# EAGLE design bc29 (EAGLE 7.1.0)
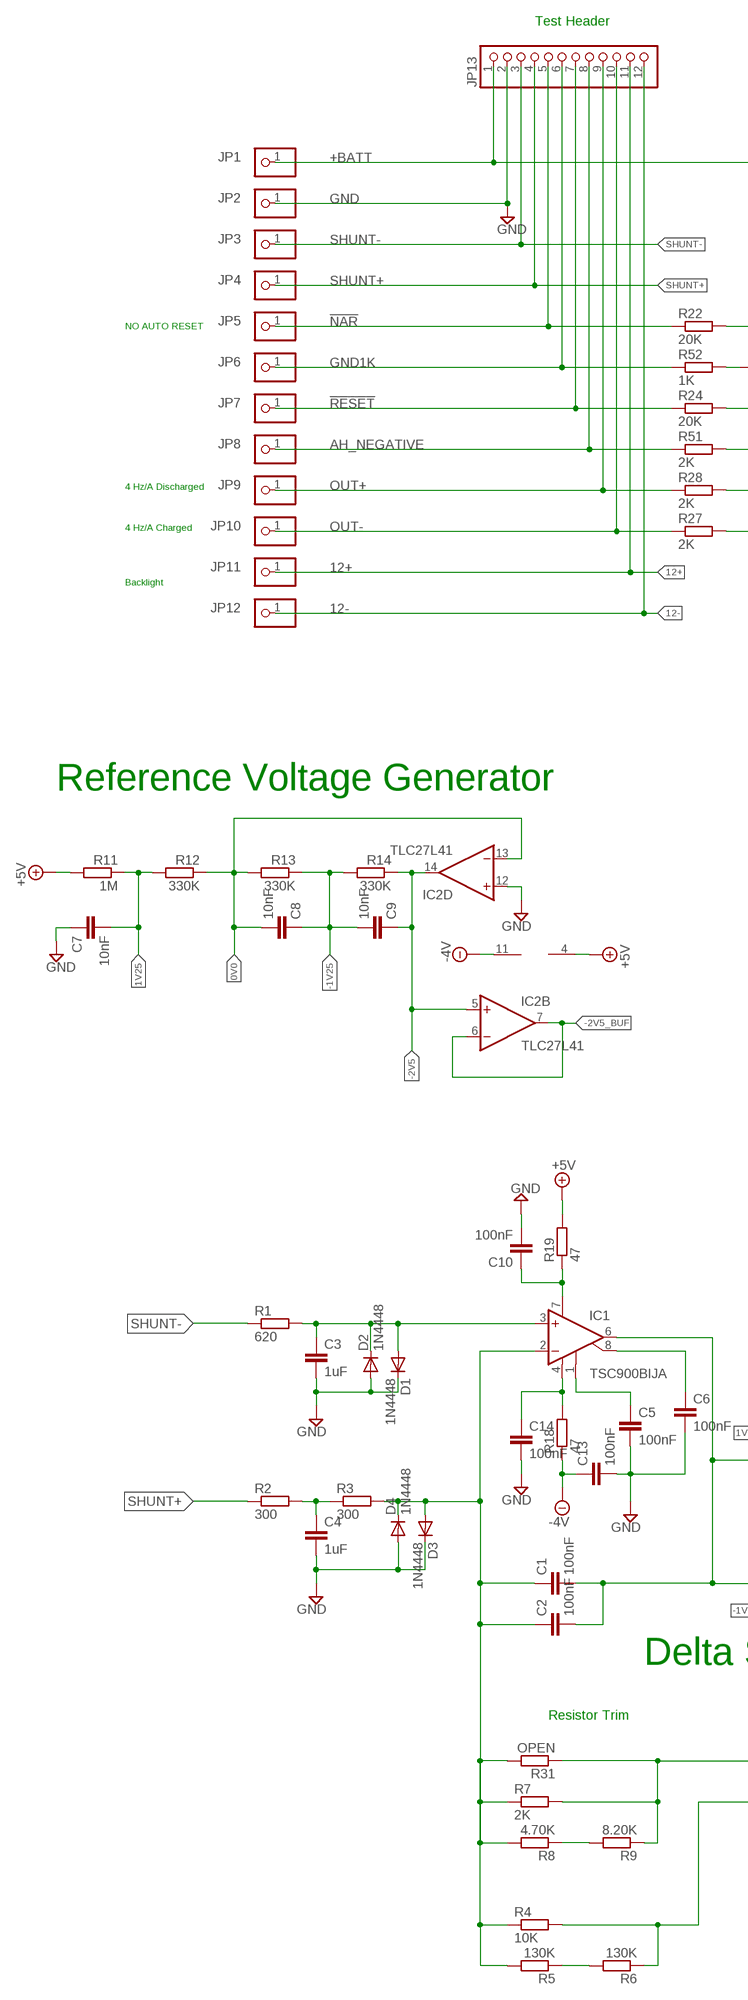
[diagram p0: schematic, sheet 1, part 1 of 2]
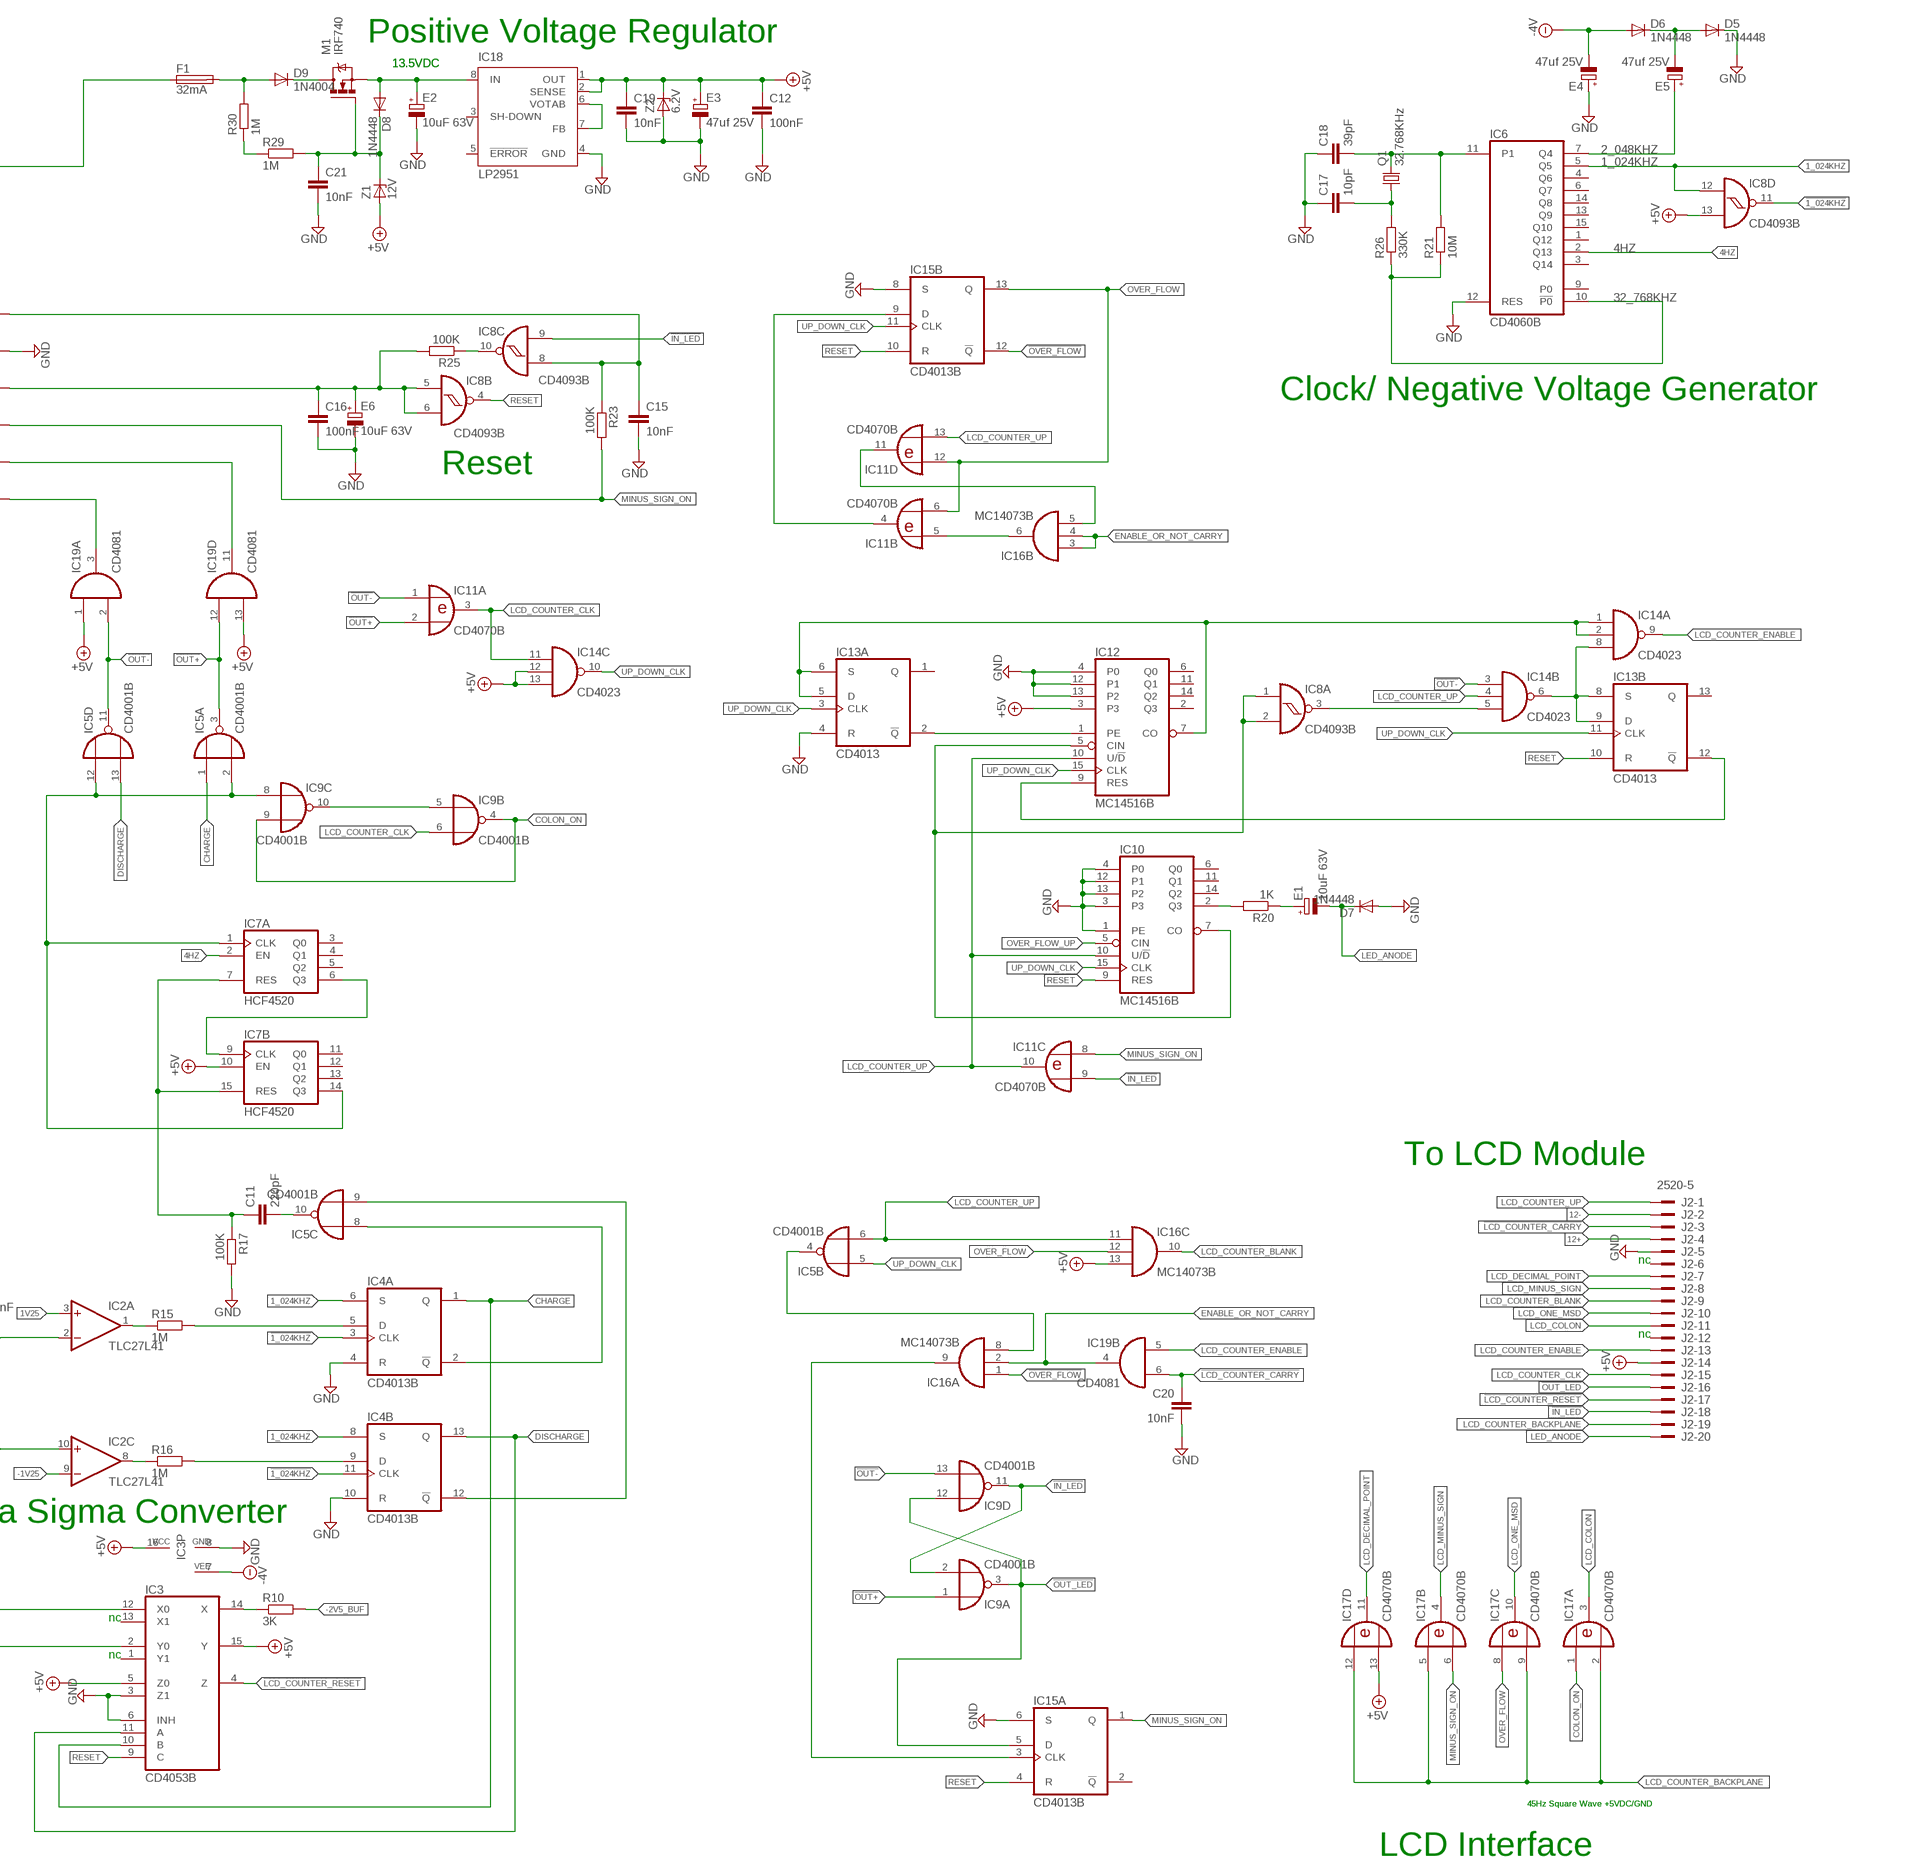
[diagram p1: schematic, sheet 1, part 2 of 2]

## Parts
C1  100nF  C-EUC1206  [C1206]
C2  100nF  C-EUC1206  [C1206]
C3  1uF  C-EU050-045X075  [C050-045X075]
C4  1uF  C-EU050-045X075  [C050-045X075]
C5  100nF  C-EUC1206  [C1206]
C6  100nF  C-EUC1206  [C1206]
C7  10nF  C-EUC0805  [C0805]
C8  10nF  C-EUC0805  [C0805]
C9  10nF  C-EUC0805  [C0805]
C10  100nF  C-EUC1206  [C1206]
C11  220pF  C-EUC0805  [C0805]
C12  100nF  C-EUC1206  [C1206]
C13  100nF  C-EUC1206  [C1206]
C14  100nF  C-EUC1206  [C1206]
C15  10nF  C-EUC0805  [C0805]
C16  100nF  C-EUC1206  [C1206]
C17  10pF  C-EUC0805  [C0805]
C18  39pF  C-EUC0805  [C0805]
C19  10nF  C-EUC0805  [C0805]
C20  10nF  C-EU050-024X044  [C050-024X044]
C21  10nF  C-EUC0805  [C0805]
D1  1N4448  DIODE-MINIMELF  [MINIMELF]
D2  1N4448  DIODE-MINIMELF  [MINIMELF]
D3  1N4448  DIODE-MINIMELF  [MINIMELF]
D4  1N4448  DIODE-MINIMELF  [MINIMELF]
D5  1N4448  DIODE-MINIMELF  [MINIMELF]
D6  1N4448  DIODE-MINIMELF  [MINIMELF]
D7  1N4448  DIODE-MINIMELF  [MINIMELF]
D8  1N4448  DIODE-MINIMELF  [MINIMELF]
D9  1N4004  DIODE-SOD80C  [SOD80C]
E1  10uF 63V  CPOL-EUE2.5-5  [E2,5-5]
E2  10uF 63V  CPOL-EUE2.5-5  [E2,5-5]
E3  47uf 25V  CPOL-EUE2.5-5  [E2,5-5]
E4  47uf 25V  CPOL-EUE2.5-5  [E2,5-5]
E5  47uf 25V  CPOL-EUE2.5-5  [E2,5-5]
E6  10uF 63V  CPOL-EUE2.5-5  [E2,5-5]
F1  32mA  FUSEBLANK_5X20MM  [FUSE_HOLDER_5X20MM]
IC1  TSC900BIJA  2CMPN  [DIL08]
IC2  TLC27L41  TLC274D  [SO14]
IC3  CD4053B  4053D  [SO16]
IC4  CD4013B  4013D  [SO14]
IC5  CD4001B  4001D  [SO14]
IC6  CD4060B  4060D  [SO16]
IC7  HCF4520  4520D  [SO16]
IC8  CD4093B  4093D  [SO14]
IC9  CD4001B  4001D  [SO14]
IC10  MC14516B  4516D  [SO16]
IC11  CD4070B  4070D  [SO14]
IC12  MC14516B  4516D  [SO16]
IC13  CD4013  4013D  [SO14]
IC14  CD4023  4023D  [SO14]
IC15  CD4013B  4013D  [SO14]
IC16  MC14073B  4073D  [SO14]
IC17  CD4070B  4070D  [SO14]
IC18  LP2951  LP2951D  [SO08]
IC19  CD4081  4081D  [SO14]
J2  2520-5  [PAK100/2500-5-20]
JP1  PINHD-1X1  [1X01]
JP2  PINHD-1X1  [1X01]
JP3  PINHD-1X1  [1X01]
JP4  PINHD-1X1  [1X01]
JP5  PINHD-1X1  [1X01]
JP6  PINHD-1X1  [1X01]
JP7  PINHD-1X1  [1X01]
JP8  PINHD-1X1  [1X01]
JP9  PINHD-1X1  [1X01]
JP10  PINHD-1X1  [1X01]
JP11  PINHD-1X1  [1X01]
JP12  PINHD-1X1  [1X01]
JP13  PINHD-1X12  [1X12]
M1  IRF740  [TO220BV]
Q1  32.768KHz  CRYSTALTC26H  [TC26H]
R1  620  R-EU_M0805  [M0805]
R2  300  R-EU_M0805  [M0805]
R3  300  R-EU_M0805  [M0805]
R4  10K  R-EU_M0805  [M0805]
R5  130K  R-EU_0207/10  [0207/10]
R6  130K  R-EU_0207/10  [0207/10]
R7  2K  R-EU_M0805  [M0805]
R8  4.70K  R-EU_0207/10  [0207/10]
R9  8.20K  R-EU_0207/10  [0207/10]
R10  3K  R-EU_M0805  [M0805]
R11  1M  R-EU_M0805  [M0805]
R12  330K  R-EU_M0805  [M0805]
R13  330K  R-EU_M0805  [M0805]
R14  330K  R-EU_M0805  [M0805]
R15  1M  R-EU_M0805  [M0805]
R16  1M  R-EU_M0805  [M0805]
R17  100K  R-EU_M0805  [M0805]
R18  47  R-EU_M0805  [M0805]
R19  47  R-EU_M0805  [M0805]
R20  1K  R-EU_M0805  [M0805]
R21  10M  R-EU_M0805  [M0805]
R22  20K  R-EU_M0805  [M0805]
R23  100K  R-EU_M0805  [M0805]
R24  20K  R-EU_M0805  [M0805]
R25  100K  R-EU_M0805  [M0805]
R26  330K  R-EU_M0805  [M0805]
R27  2K  R-EU_M0805  [M0805]
R28  2K  R-EU_M0805  [M0805]
R29  1M  R-EU_M0805  [M0805]
R30  1M  R-EU_M0805  [M0805]
R31  OPEN  R-EU_0207/10  [0207/10]
R51  2K  R-EU_M0805  [M0805]
R52  1K  R-EU_M0805  [M0805]
Z1  12V  ZENER-DIODESOD80C  [SOD80C]
Z2  6.2V  ZENER-DIODESOD80C  [SOD80C]

## Nets
0V0: C8.2 IC2.13(D:-IN) R12.1 R13.2
1_024KHZ: IC4.6(A:S) IC4.8(B:S) IC6.5(Q5) IC8.12(D:I0)
1V25: C7.2 IC2.3(A:+IN) R11.1 R12.2
2_048KHZ: E5.+ IC6.7(Q4)
4HZ: IC6.2(Q13) IC7.2(A:EN)
12+: J2.4 JP11.1 JP13.11
12-: J2.2 JP12.1 JP13.12
13V5: D8.A E2.+ IC18.8(IN) M1.S
32_768KHZ: IC6.10(!P0) R21.1 R26.1
!1_024KHZ: IC4.3(A:CLK) IC4.11(B:CLK) IC8.11(D:O)
!CHARGE: IC4.2(A:!Q) IC5.8(C:I0)
!DISCHARGE: IC4.12(B:!Q) IC5.9(C:I1)
!IN_LED: IC8.9(C:I1) IC9.2(A:I1) IC9.11(D:O) IC11.9(C:I1) J2.18
!LCD_COUNTER_CARRY: C20.1 IC19.6(B:I1) J2.3
!LCD_COUNTER_RESET: IC3.4(Z) J2.17
!NAR: JP5.1 JP13.5 R22.1
!NAR_R: C15.1 IC8.8(C:I0) R22.2 R23.1
!OUT+: IC5.3(A:O) IC9.1(A:I0) IC11.2(A:I1) IC19.12(D:I0)
!OUT-: IC5.11(D:O) IC9.13(D:I1) IC11.1(A:I0) IC14.3(B:I0) IC19.2(A:I1)
!OUT_LED: IC9.3(A:O) IC9.12(D:I0) IC15.5(A:D) J2.16
!OVER_FLOW: IC15.12(B:!Q) IC16.1(A:I0)
!RESET: JP7.1 JP13.7 R24.1
+5V: C12.1 C19.1 E3.+ IC2.4(P:V+) IC3.5(Z0) IC3.15(Y) IC3.16(VCC) IC7.10(B:EN) IC8.13(D:I1) IC12.3 IC14.12(C:I1) IC14.13(C:I2) IC16.13(C:I2) IC17.13(D:I1) IC18.1(OUT) IC18.2(SENSE) IC19.1(A:I0) IC19.13(D:I1) J2.14 R11.2 R19.2 Z1.A Z2.C
+BATT: F1.1 JP1.1 JP13.1
-1V25: C8.1 C9.2 IC2.9(C:-IN) R13.1 R14.2
-2V5: C9.1 IC2.5(B:+IN) IC2.14(D:OUT) R14.1
-2V5_BUF: IC2.6(B:-IN) IC2.7(B:OUT) R10.2
-2V5_BUF_R: IC3.14(X) R10.1
-4V: D6.A E4.-
-5V: C13.1 IC2.11(P:V-) IC3.7(VEE) R18.1 ; supply symbol labelled -4V
AH_NEGATIVE: JP8.1 JP13.8 R51.1
CHARGE: IC3.10(B) IC4.1(A:Q) IC5.1(A:I0)
COLON_ON: IC9.4(B:O) IC9.9(C:I1) IC17.1(A:I0)
CXA: C5.1 IC1.1(CMP1)
CXB: C6.1 IC1.8(CMP2)
D_CHARGE: IC4.5(A:D) R15.2
D_DISCHARGE: IC4.9(B:D) R16.2
DISCHARGE: IC3.11(A) IC4.13(B:Q) IC5.13(D:I1)
DRAIN: D9.C M1.D
ENABLE_OR_NOT_CARRY: IC16.2(A:I1) IC16.3(B:I0) IC16.4(B:I1) IC19.4(B:O)
FUSED_BATT+: D9.A F1.2 R30.2
GATE: C21.1 D8.C M1.G R29.2 Z1.C
GND: C3.2 C4.2 C5.2 C6.2 C7.1 C10.2 C12.2 C13.2 C14.2 C15.2 C16.2 C17.1 C18.1 C19.2 C20.2 C21.2 D1.C D2.A D3.C D4.A D5.C D7.A E2.- E3.- E4.+ E6.- IC2.12(D:+IN) IC3.3(Z1) IC3.6(INH) IC3.8(GND) IC4.4(A:R) IC4.10(B:R) IC6.12(RES) IC10.1(PE) IC10.3 IC10.4(P0) IC10.12(P1) IC10.13(P2) IC12.4(P0) IC12.12(P1) IC12.13(P2) IC13.4(A:R) IC15.6(A:S) IC15.8(B:S) IC18.4(GND) J2.5 JP2.1 JP13.2 R17.2 R52.2 Z2.A
GND1K: JP6.1 JP13.6 R52.1
IC3-11: IC11.11(D:O) IC16.5(B:I2)
IC5-4: IC5.4(B:O) IC16.8(A:I2)
IC7-14: IC5.2(A:I1) IC5.12(D:I0) IC7.1(A:CLK) IC7.14(B:Q3) IC9.8(C:I0)
IC8-3: IC8.3(A:O) IC14.5(B:I2)
IC10-7: IC8.1(A:I0) IC8.2(A:I1) IC10.7(CO) IC12.5(CIN)
IC13-5: IC12.7(CO) IC13.5(A:D) IC13.6(A:S) IC14.1(A:I0) IC14.2(A:I1)
IC14-6: IC13.8(B:S) IC13.9(B:D) IC14.6(B:O) IC14.8(A:I2)
IC15-3: IC15.3(A:CLK) IC16.9(A:O)
IN+: C3.1 D1.A D2.C IC1.3(+IN) R1.2
IN-: C1.1 C2.1 D3.A D4.C IC1.2(-IN) R3.2 R4.1 R5.2 R7.1 R8.2 R31.2
LCD_COLON: IC17.3(A:O) J2.11
LCD_COUNTER_BACKPLANE: IC17.2(A:I1) IC17.5(B:I0) IC17.9(C:I1) IC17.12(D:I0) J2.19
LCD_COUNTER_BLANK: IC16.10(C:O) J2.9
LCD_COUNTER_CLK: IC9.6(B:I1) IC11.3(A:O) IC14.11(C:I0) J2.15
LCD_COUNTER_ENABLE: IC14.9(A:O) IC19.5(B:I0) J2.13
LCD_COUNTER_UP: IC5.6(B:I1) IC10.10(U/!D) IC11.10(C:O) IC11.13(D:I1) IC12.10(U/!D) IC14.4(B:I1) IC16.11(C:I0) J2.1
LCD_DECIMAL_POINT: IC17.11(D:O) J2.7
LCD_MINUS_SIGN: IC17.4(B:O) J2.8
LCD_ONE_MSD: IC17.10(C:O) J2.10
LED_ANODE: D7.C E1.- J2.20
MINUS_SIGN_ON: IC11.8(C:I0) IC15.1(A:Q) IC17.6(B:I1) R23.2 R51.2
N$13: C11.2 IC5.10(C:O)
N$15: IC12.9(RES) IC13.12(B:!Q)
N$16: IC11.4(B:O) IC15.9(B:D)
N$17: IC12.1(PE) IC13.2(A:!Q)
N$23: IC7.6(A:Q3) IC7.9(B:CLK)
N$24: C11.1 IC7.7(A:RES) IC7.15(B:RES) R17.1
N$25: IC9.5(B:I0) IC9.10(C:O)
N$26: IC11.5(B:I0) IC16.6(B:O)
N$29: R29.1 R30.1
N$32: IC10.2(Q3) R20.2
N$38: D5.A D6.C E5.-
N$39: C17.2 Q1.1 R26.2
N$40: C18.2 IC6.11(P1) Q1.2 R21.2
N$42: R5.1 R6.2
N$44: IC18.6(VOTAB) IC18.7(FB)
N$45: R8.1 R9.2
N$48: IC8.10(C:O) R25.1
N$54: E1.+ R20.1
NEG_COMPARATOR: IC2.8(C:OUT) R16.1
OP_AMP__OUT: C1.2 C2.2 IC1.6(OUT) IC2.2(A:-IN) IC2.10(C:+IN)
OUT+: JP9.1 JP13.9 R28.1
OUT+_R: IC19.11(D:O) R28.2
OUT-: JP10.1 JP13.10 R27.1
OUT-_R: IC19.3(A:O) R27.2
OVER_FLOW: IC11.6(B:I1) IC11.12(D:I0) IC15.13(B:Q) IC16.12(C:I1) IC17.8(C:I0)
OVER_FLOW_UP: IC10.5(CIN)
POS_COMPARATOR: IC2.1(A:OUT) R15.1
RESET: IC3.9(C) IC8.4(B:O) IC10.9(RES) IC13.10(B:R) IC15.4(A:R) IC15.10(B:R)
RESET_R: C16.1 E6.+ IC8.5(B:I0) IC8.6(B:I1) R24.2 R25.2
SHUNT+: JP4.1 JP13.4 R2.1
SHUNT+FILTER: C4.1 R2.2 R3.1
SHUNT-: JP3.1 JP13.3 R1.1
UP_DOWN_CLK: IC5.5(B:I0) IC10.15(CLK) IC12.15(CLK) IC13.3(A:CLK) IC13.11(B:CLK) IC14.10(C:O) IC15.11(B:CLK)
VDD+: C10.1 IC1.7(V+) R19.1
VDD-: C14.1 IC1.4(V-) R18.2
X0: IC3.12(X0) R7.2 R9.1 R31.1
Y0: IC3.2(Y0) R4.2 R6.1
Unconnected: IC3.1(Y1) IC3.13(X1) IC6.1(Q12) IC6.3(Q14) IC6.4(Q6) IC6.6(Q7) IC6.9(P0) IC6.13(Q9) IC6.14(Q8) IC6.15(Q10) IC7.3(A:Q0) IC7.4(A:Q1) IC7.5(A:Q2) IC7.11(B:Q0) IC7.12(B:Q1) IC7.13(B:Q2) IC10.6(Q0) IC10.11(Q1) IC10.14(Q2) IC12.2(Q3) IC12.6(Q0) IC12.11(Q1) IC12.14(Q2) IC13.1(A:Q) IC13.13(B:Q) IC15.2(A:!Q) IC18.3(SH-DOWN) IC18.5(!ERROR) IC19.8(C:I0) IC19.9(C:I1) IC19.10(C:O) J2.6 J2.12

## Notes on the sheet
- Test Header | Positive Voltage Regulator
- 13.5VDC | 13.5VDC
- NO AUTO RESET
- Clock/ Negative Voltage Generator
- 4 Hz/A Discharged
- Reset
- 4 Hz/A Charged
- Backlight
- Reference Voltage Generator
- To LCD Module
- nc
- nc
- Delta Sigma Converter
- Resistor Trim
- nc
- nc
- 45Hz Square Wave +5VDC/GND | 45Hz Square Wave +5VDC/GND
- LCD Interface

## Power pins joined to a net without a drawn wire
VDD: IC4.14(P:VDD) IC5.14(P:VDD) IC6.16(VDD) IC7.16(P:VDD) IC8.14(P:VDD) IC9.14(P:VDD) IC10.16(VDD) IC11.14(P:VDD) IC12.16(VDD) IC13.14(P:VDD) IC14.14(P:VDD) IC15.14(P:VDD) IC16.14(P:VDD) IC17.14(P:VDD) IC19.14(P:VDD)
VSS: IC4.7(P:VSS) IC5.7(P:VSS) IC6.8(VSS) IC7.8(P:VSS) IC8.7(P:VSS) IC9.7(P:VSS) IC10.8(VSS) IC11.7(P:VSS) IC12.8(VSS) IC13.7(P:VSS) IC14.7(P:VSS) IC15.7(P:VSS) IC16.7(P:VSS) IC17.7(P:VSS) IC19.7(P:VSS)

## Library data of the parts
C1-C21 = rcl:C-EU: CAPACITOR, European symbol
D1-D9 = diode:DIODE-: DIODE
E1-E6 = rcl:CPOL-EU: POLARIZED CAPACITOR, European symbol
F1 = fuse:FUSE: Fuse; OC_FARNELL: unknown; OC_NEWARK: unknown
IC1 = linear:2CMP: OP AMP
IC2 = linear:TLC274: OP AMP
IC3 = 40xx:4053: Triple 2-channel ANALOG MULTIPLEXER
IC4 IC13 IC15 = 40xx:4013: Dual D FLIP FLOP, set/reset
IC5 IC9 = 40xx:4001: Quad 2-input NOR
IC6 = 40xx:4060: 14-stage binary/ripple COUNTER
IC7 = 45xx:4520: Dual binary up COUNTER
IC8 = 40xx:4093: Quad 2-input NAND schmitt trigger
IC10 IC12 = 45xx:4516: Binary up down COUNTER
IC11 IC17 = 40xx:4070: Quad 2-input XOR
IC14 = 40xx:4023: Triple 3-input NAND
IC16 = 40xx:4073: Triple 3-input AND
IC18 = linear:LP2951: 100 mA, Low Power Low Dropout Voltage Regulator Source: http://www.onsemi.com/pub/Collateral/LP2950-D.PDF
IC19 = 40xx:4081: Quad 2-input AND
J2 = con-3m:2520-: 3M (TM) Pak 100 4-Wall Header Source: 3M
JP1-JP12 = pinhead:PINHD-1X1: PIN HEADER
JP13 = pinhead:PINHD-1X12: PIN HEADER
M1 = transistor-power:IRF740: N-CHANNEL MOS FET
Q1 = crystal:CRYSTAL: CRYSTAL; OC_FARNELL: unknown; OC_NEWARK: unknown
R1-R31 R51 R52 = rcl:R-EU_: RESISTOR, European symbol
Z1 Z2 = diode:ZENER-DIODE: Z-Diode

## Board
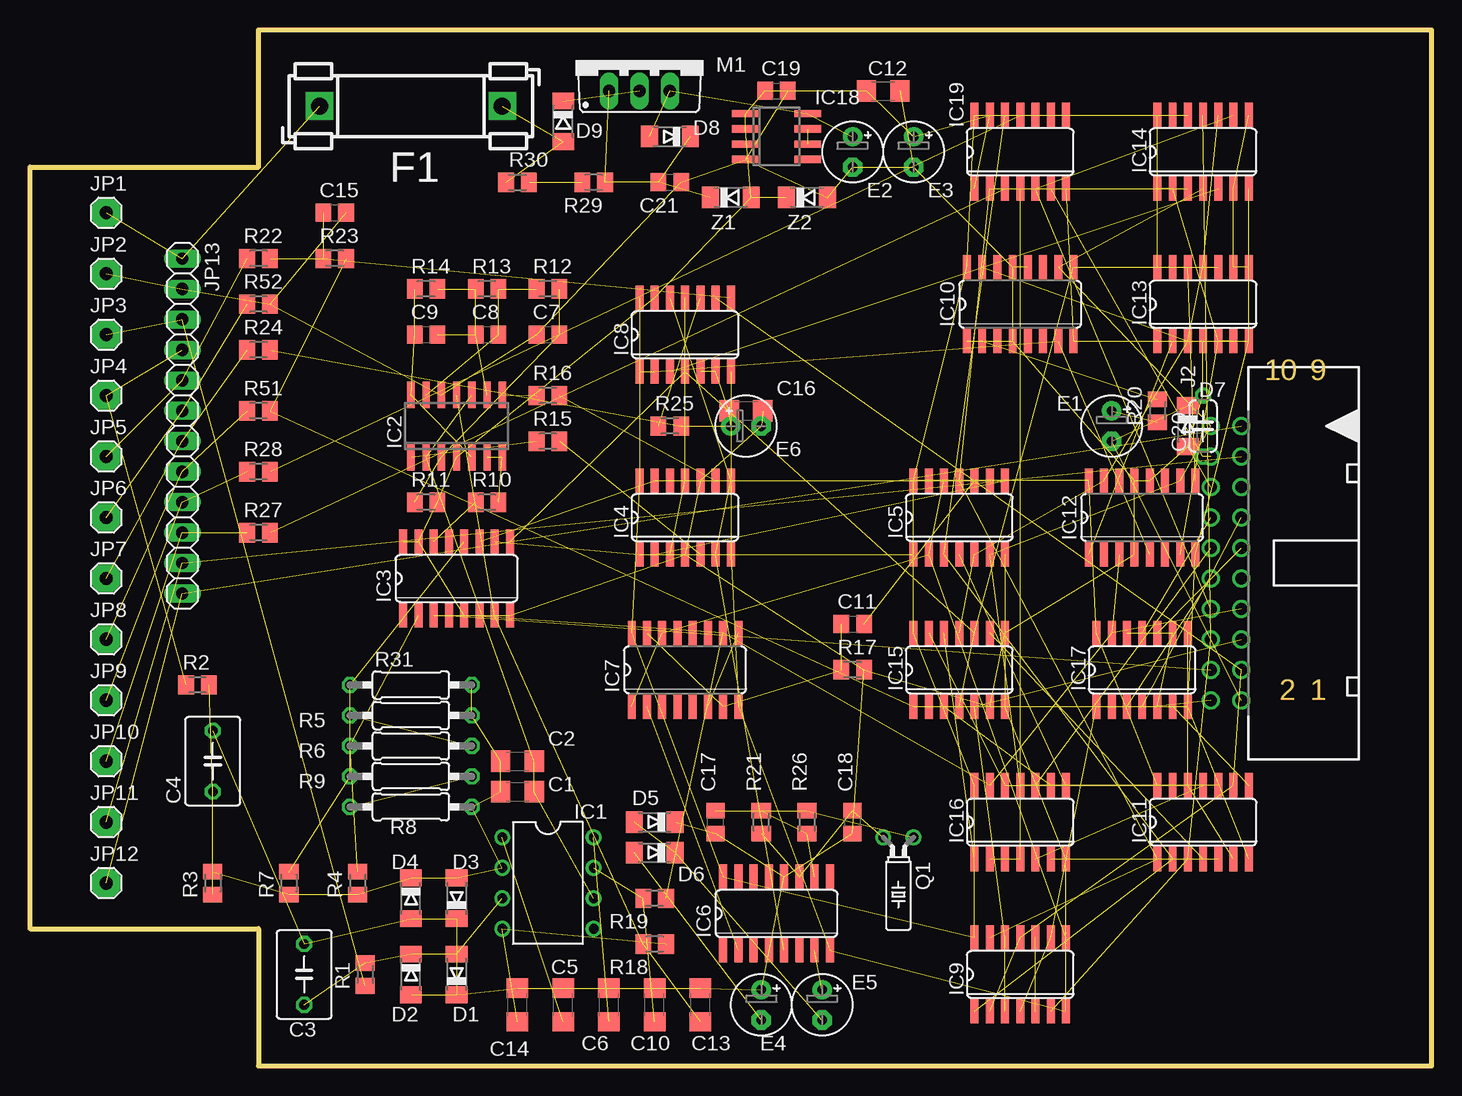
[diagram p2: board, top side]

Size 116.84 x 86.36 mm. Coordinates in mm from the lower left corner, seen from the top.
Outline: 19.05,0 116.84,0 116.84,86.36 19.05,86.36 19.05,74.93 0,74.93 0,11.43 19.05,11.43 19.05,0
Copper layers (1*16): Top 0.035mm / dielectric 1.5mm / Bottom 0.035mm
Design rules "default": minimum track width 10mil, minimum drill 24mil, track to track 8mil, track to pad 8mil, pad to pad 8mil, via to via 8mil, smd to smd 8mil, copper to edge 40mil, drill to drill 8mil, minimum pad ring 10mil, minimum via ring 8mil, stop-mask expansion 4mil, vias tented up to drill 0mil, thermal gap 10mil

### Footprints (pad centres in the part's own frame; a part is rotated, then mirrored left to right if it is on the bottom)
C1206 = smd 1.6 x 1.8: 1 -1.4,0; 2 1.4,0
C050-045X075 = drill 0.813 octagon: 1 -2.54,0; 2 2.54,0
C0805 = smd 1.3 x 1.5: 1 -0.95,0; 2 0.95,0
C050-024X044 = drill 0.813 octagon: 1 -2.54,0; 2 2.54,0
MINIMELF = smd 1.4 x 1.8: A 1.7,0; C -1.7,0
SOD80C = smd 1.4 x 1.8: A 1.7,0; C -1.7,0
E2,5-5 = drill 0.813 pad 1.6: + -1.27,0 | drill 0.813 pad 1.6 octagon: - 1.27,0
FUSE_HOLDER_5X20MM = drill 1.422 pad 2.286 square: 1 0,0; 2 15.24,0
DIL08 = drill 0.813 pad 1.27: 1 -3.81,-3.81; 2 -1.27,-3.81; 3 1.27,-3.81; 4 3.81,-3.81; 5 3.81,3.81; 6 1.27,3.81; 7 -1.27,3.81; 8 -3.81,3.81
SO14 = smd 0.6 x 2.2: 1 -3.81,-2.6; 2 -2.54,-2.6; 3 -1.27,-2.6; 4 0,-2.6; 5 1.27,-2.6; 6 2.54,-2.6; 7 3.81,-2.6; 8 3.81,2.6; 9 2.54,2.6; 10 1.27,2.6; 11 0,2.6; 12 -1.27,2.6; 13 -2.54,2.6; 14 -3.81,2.6
SO16 = smd 0.66 x 2.032: 1 -4.445,-3.073; 2 -3.175,-3.073; 3 -1.905,-3.073; 4 -0.635,-3.073; 5 0.635,-3.073; 6 1.905,-3.073; 7 3.175,-3.073; 8 4.445,-3.073; 9 4.445,3.073; 10 3.175,3.073; 11 1.905,3.073; 12 0.635,3.073; 13 -0.635,3.073; 14 -1.905,3.073; 15 -3.175,3.073; 16 -4.445,3.073
SO14' = smd 0.66 x 2.032: 1 -3.81,-3.073; 2 -2.54,-3.073; 3 -1.27,-3.073; 4 0,-3.073; 5 1.27,-3.073; 6 2.54,-3.073; 7 3.81,-3.073; 8 3.81,3.073; 9 2.54,3.073; 10 1.27,3.073; 11 0,3.073; 12 -1.27,3.073; 13 -2.54,3.073; 14 -3.81,3.073
SO08 = smd 0.6 x 2.2: 1 -1.905,-2.6; 2 -0.635,-2.6; 3 0.635,-2.6; 4 1.905,-2.6; 5 1.905,2.6; 6 0.635,2.6; 7 -0.635,2.6; 8 -1.905,2.6
PAK100/2500-5-20 = drill 1 pad 1.422: 1 -11.43,-1.27; 2 -11.43,1.27; 3 -8.89,-1.27; 4 -8.89,1.27; 5 -6.35,-1.27; 6 -6.35,1.27; 7 -3.81,-1.27; 8 -3.81,1.27; 9 -1.27,-1.27; 10 -1.27,1.27; 11 1.27,-1.27; 12 1.27,1.27; 13 3.81,-1.27; 14 3.81,1.27; 15 6.35,-1.27; 16 6.35,1.27; 17 8.89,-1.27; 18 8.89,1.27; 19 11.43,-1.27; 20 11.43,1.27
1X01 = drill 1.016 octagon: 1 0,0
1X12 = drill 1.016 long: 1 -13.97,0; 2 -11.43,0; 3 -8.89,0; 4 -6.35,0; 5 -3.81,0; 6 -1.27,0; 7 1.27,0; 8 3.81,0; 9 6.35,0; 10 8.89,0; 11 11.43,0; 12 13.97,0
TO220BV = drill 1.016 long: D 0,-2.54; G -2.54,-2.54; S 2.54,-2.54
TC26H = drill 0.813: 1 -1.27,0; 2 1.27,0
M0805 = smd 1.3 x 1.6: 1 -0.95,0; 2 0.95,0
0207/10 = drill 0.813 octagon: 1 -5.08,0; 2 5.08,0

### Placement (x,y rotation side)
C1  40.64,22.86 0 top
C2  40.64,25.4 0 top
C3  22.86,7.62 90 top
C4  15.24,25.4 90 top
C5  44.45,5.08 90 top
C6  48.26,5.08 90 top
C7  43.18,60.96 0 top
C8  38.1,60.96 0 top
C9  33.02,60.96 0 top
C10  52.07,5.08 90 top
C11  68.58,36.83 0 top
C12  71.12,81.28 0 top
C13  55.88,5.08 90 top
C14  40.64,5.08 90 top
C15  25.4,71.12 0 top
C16  59.69,54.61 0 top
C17  57.15,20.32 90 top
C18  68.58,20.32 90 top
C19  62.23,81.28 0 top
C20  97.79,53.34 90 top
C21  53.34,73.66 0 top
D1  35.56,7.62 90 top
D2  31.75,7.62 270 top
D3  35.56,13.97 90 top
D4  31.75,13.97 270 top
D5  52.07,20.32 180 top
D6  52.07,17.78 180 top
D7  96.52,53.34 270 top
D8  53.34,77.47 180 top
D9  44.45,78.74 270 top
E1  90.17,53.34 270 top
E2  68.58,76.2 270 top
E3  73.66,76.2 270 top
E4  60.96,5.08 270 top
E5  66.04,5.08 270 top
E6  59.69,53.34 0 top
F1  24.13,80.01 0 top
IC1  43.18,15.24 270 top
IC2  35.56,53.34 0 top
IC3  35.56,40.64 0 top
IC4  CD4013B  [SO14']  54.61,45.72 0 top
IC5  CD4001B  [SO14']  77.47,45.72 0 top
IC6  62.23,12.7 0 top
IC7  54.61,33.02 0 top
IC8  CD4093B  [SO14']  54.61,60.96 0 top
IC9  CD4001B  [SO14']  82.55,7.62 0 top
IC10  82.55,63.5 0 top
IC11  CD4070B  [SO14']  97.79,20.32 0 top
IC12  92.71,45.72 0 top
IC13  CD4013  [SO14']  97.79,63.5 0 top
IC14  CD4023  [SO14']  97.79,76.2 0 top
IC15  CD4013B  [SO14']  77.47,33.02 0 top
IC16  MC14073B  [SO14']  82.55,20.32 0 top
IC17  CD4070B  [SO14']  92.71,33.02 0 top
IC18  62.23,77.47 270 top
IC19  CD4081  [SO14']  82.55,76.2 0 top
J2  99.69,41.91 270 top
JP1  6.35,71.12 0 top
JP2  6.35,66.04 0 top
JP3  6.35,60.96 0 top
JP4  6.35,55.88 0 top
JP5  6.35,50.8 0 top
JP6  6.35,45.72 0 top
JP7  6.35,40.64 0 top
JP8  6.35,35.56 0 top
JP9  6.35,30.48 0 top
JP10  6.35,25.4 0 top
JP11  6.35,20.32 0 top
JP12  6.35,15.24 0 top
JP13  12.7,53.34 270 top
M1  50.8,83.82 0 top
Q1  72.39,19.05 180 top
R1  27.94,7.62 90 top
R2  13.97,31.75 0 top
R3  15.24,15.24 90 top
R4  27.3,15.24 90 top
R5  31.75,29.21 0 top
R6  31.75,26.67 0 top
R7  21.59,15.24 90 top
R8  31.75,21.59 0 top
R9  31.75,24.13 0 top
R10  38.1,46.99 0 top
R11  33.02,46.99 0 top
R12  43.18,64.77 0 top
R13  38.1,64.77 0 top
R14  33.02,64.77 0 top
R15  43.18,52.07 0 top
R16  43.18,55.88 0 top
R17  68.58,33.02 0 top
R18  52.07,10.16 0 top
R19  52.07,13.97 0 top
R20  93.98,54.61 90 top
R21  60.96,20.32 270 top
R22  19.05,67.31 0 top
R23  25.4,67.31 0 top
R24  19.05,59.69 0 top
R25  53.34,53.34 0 top
R26  64.77,20.32 90 top
R27  19.05,44.45 0 top
R28  19.05,49.53 0 top
R29  46.99,73.66 0 top
R30  40.64,73.66 180 top
R31  31.75,31.75 0 top
R51  19.05,54.61 0 top
R52  19.05,63.5 0 top
Z1  58.42,72.39 0 top
Z2  64.77,72.39 0 top

### Tracks (layer width: path | path; a pad name or v marks a point on that pad's centre or on a via)
0V0  (3 unrouted)
1_024KHZ  (3 unrouted)
1V25  (3 unrouted)
2_048KHZ  (1 unrouted)
4HZ  (1 unrouted)
12+  (2 unrouted)
12-  (2 unrouted)
13V5  (3 unrouted)
32_768KHZ  (2 unrouted)
!1_024KHZ  (2 unrouted)
!CHARGE  (1 unrouted)
!DISCHARGE  (1 unrouted)
!IN_LED  (4 unrouted)
!LCD_COUNTER_CARRY  (2 unrouted)
!LCD_COUNTER_RESET  (1 unrouted)
!NAR  (2 unrouted)
!NAR_R  (3 unrouted)
!OUT+  (3 unrouted)
!OUT-  (4 unrouted)
!OUT_LED  (3 unrouted)
!OVER_FLOW  (1 unrouted)
!RESET  (2 unrouted)
+5V  (22 unrouted)
+BATT  (2 unrouted)
-1V25  (4 unrouted)
-2V5  (3 unrouted)
-2V5_BUF  (2 unrouted)
-2V5_BUF_R  (1 unrouted)
-4V  (1 unrouted)
-5V  (3 unrouted)
AH_NEGATIVE  (2 unrouted)
CHARGE  (2 unrouted)
COLON_ON  (2 unrouted)
CXA  (1 unrouted)
CXB  (1 unrouted)
D_CHARGE  (1 unrouted)
D_DISCHARGE  (1 unrouted)
DISCHARGE  (2 unrouted)
DRAIN  (1 unrouted)
ENABLE_OR_NOT_CARRY  (3 unrouted)
FUSED_BATT+  (2 unrouted)
GATE  (4 unrouted)
GND  (50 unrouted)
GND1K  (2 unrouted)
IC3-11  (1 unrouted)
IC5-4  (1 unrouted)
IC7-14  (4 unrouted)
IC8-3  (1 unrouted)
IC10-7  (3 unrouted)
IC13-5  (4 unrouted)
IC14-6  (3 unrouted)
IC15-3  (1 unrouted)
IN+  (4 unrouted)
IN-  (10 unrouted)
LCD_COLON  (1 unrouted)
LCD_COUNTER_BACKPLANE  (4 unrouted)
LCD_COUNTER_BLANK  (1 unrouted)
LCD_COUNTER_CLK  (3 unrouted)
LCD_COUNTER_ENABLE  (2 unrouted)
LCD_COUNTER_UP  (7 unrouted)
LCD_DECIMAL_POINT  (1 unrouted)
LCD_MINUS_SIGN  (1 unrouted)
LCD_ONE_MSD  (1 unrouted)
LED_ANODE  (2 unrouted)
MINUS_SIGN_ON  (4 unrouted)
N$1  (via drill 1.1 pad 2.54)
  other vias: 6.35,25.4
N$2  (via drill 1.1 pad 2.54)
  other vias: 6.35,20.32
N$3  (via drill 1.1 pad 2.54)
  other vias: 6.35,15.24
N$4  (via drill 1.1 pad 2.54)
  other vias: 6.35,30.48
N$5  (via drill 1.1 pad 2.54)
  other vias: 6.35,35.56
N$6  (via drill 1.1 pad 2.54)
  other vias: 6.35,40.64
N$7  (via drill 1.1 pad 2.54)
  other vias: 6.35,45.72
N$8  (via drill 1.1 pad 2.54)
  other vias: 6.35,50.8
N$9  (via drill 1.1 pad 2.54)
  other vias: 6.35,55.88
N$10  (via drill 1.1 pad 2.54)
  other vias: 6.35,60.96
N$11  (via drill 1.1 pad 2.54)
  other vias: 6.35,66.04
N$12  (via drill 1.1 pad 2.54)
  other vias: 6.35,71.12
N$13  (1 unrouted)
N$15  (1 unrouted)
N$16  (1 unrouted)
N$17  (1 unrouted)
N$23  (1 unrouted)
N$24  (3 unrouted)
N$25  (1 unrouted)
N$26  (1 unrouted)
N$29  (1 unrouted)
N$32  (1 unrouted)
N$38  (2 unrouted)
N$39  (2 unrouted)
N$40  (3 unrouted)
N$42  (1 unrouted)
N$44  (1 unrouted)
N$45  (1 unrouted)
N$48  (1 unrouted)
N$54  (1 unrouted)
NEG_COMPARATOR  (1 unrouted)
OP_AMP__OUT  (4 unrouted)
OUT+  (2 unrouted)
OUT+_R  (1 unrouted)
OUT-  (2 unrouted)
OUT-_R  (1 unrouted)
OVER_FLOW  (4 unrouted)
POS_COMPARATOR  (1 unrouted)
RESET  (5 unrouted)
RESET_R  (5 unrouted)
SHUNT+  (2 unrouted)
SHUNT+FILTER  (2 unrouted)
SHUNT-  (2 unrouted)
UP_DOWN_CLK  (6 unrouted)
VDD  (14 unrouted)
VDD+  (2 unrouted)
VDD-  (2 unrouted)
VSS  (14 unrouted)
X0  (3 unrouted)
Y0  (2 unrouted)

### Text on the board
Dimension: 10 | 9 | 2 | 1